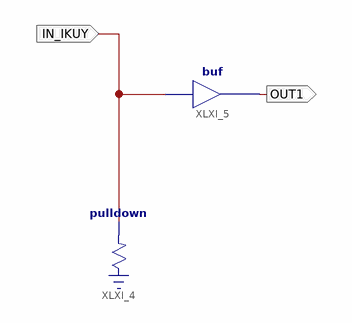
[diagram p0: schematic sheet 1]
// Xilinx ISE schematic LED.sch (spartan6) as structural Verilog: 2 symbols, 2 ports
module LED (
  input  IN_IKUY,
  output OUT1
);

  \pulldown  XLXI_4 (.O(IN_IKUY));
  buf XLXI_5 (OUT1, IN_IKUY);
endmodule
